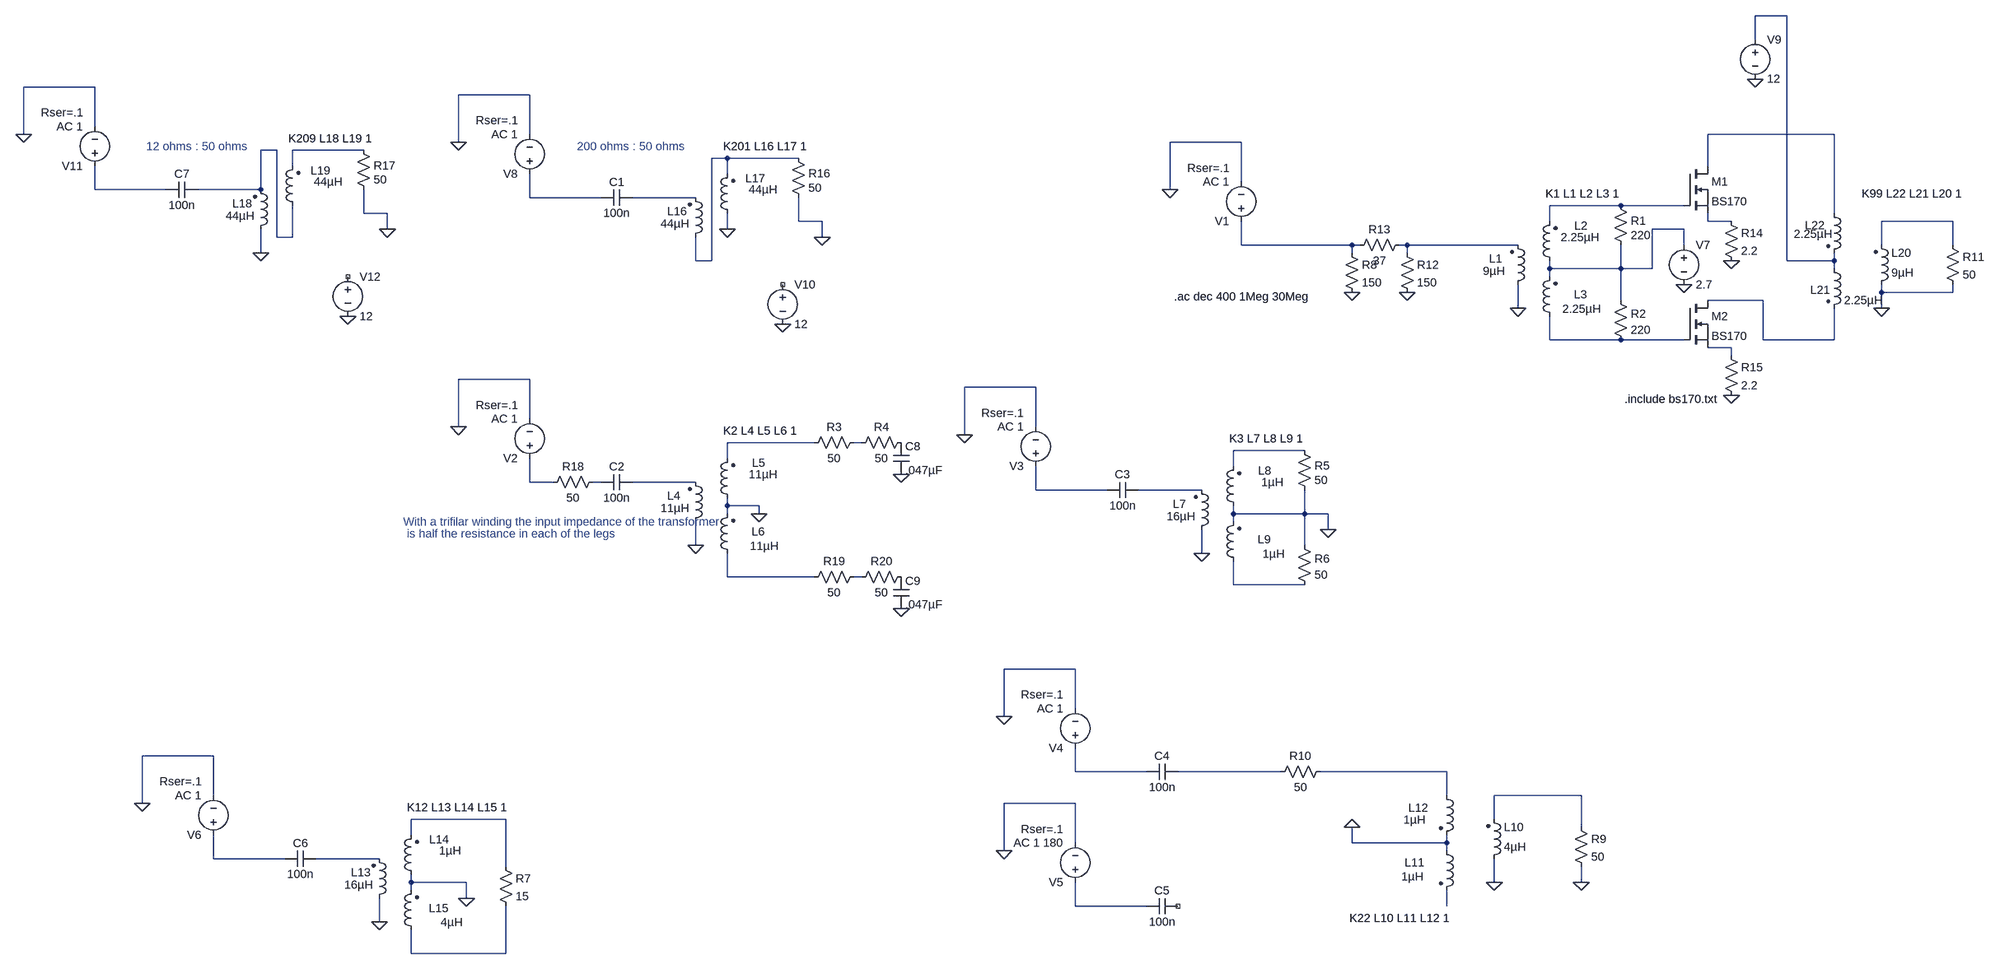
[diagram p0: schematic pushpull impedance.asc]
pushpull impedance.asc, the LTspice schematic file:
Version 4
SHEET 1 2848 1376
WIRE 2448 -1104 2384 -1104
WIRE 2384 -1056 2384 -1104
WIRE -976 -960 -1120 -960
WIRE -96 -944 -240 -944
WIRE -976 -880 -976 -960
WIRE -1120 -864 -1120 -960
WIRE -96 -864 -96 -944
WIRE 2544 -864 2288 -864
WIRE -240 -848 -240 -944
WIRE 1344 -848 1200 -848
WIRE -608 -832 -640 -832
WIRE -432 -832 -576 -832
WIRE 304 -816 272 -816
WIRE 448 -816 304 -816
WIRE -576 -800 -576 -832
WIRE 2288 -800 2288 -864
WIRE 304 -784 304 -816
WIRE 1344 -768 1344 -848
WIRE -976 -752 -976 -800
WIRE -832 -752 -976 -752
WIRE -640 -752 -640 -832
WIRE -640 -752 -768 -752
WIRE 1200 -752 1200 -848
WIRE -96 -736 -96 -784
WIRE 48 -736 -96 -736
WIRE 240 -736 112 -736
WIRE 2112 -720 1968 -720
WIRE 2240 -720 2112 -720
WIRE -432 -704 -432 -752
WIRE -384 -704 -432 -704
WIRE 2544 -704 2544 -864
WIRE 448 -688 448 -736
WIRE 496 -688 448 -688
WIRE 1968 -688 1968 -720
WIRE 2288 -688 2288 -704
WIRE 2336 -688 2288 -688
WIRE 2784 -688 2640 -688
WIRE -384 -672 -384 -704
WIRE 304 -672 304 -704
WIRE 2240 -672 2176 -672
WIRE -608 -656 -608 -832
WIRE -576 -656 -576 -720
WIRE -576 -656 -608 -656
WIRE 496 -656 496 -688
WIRE 1344 -640 1344 -688
WIRE 1568 -640 1344 -640
WIRE 1584 -640 1568 -640
WIRE 1680 -640 1664 -640
WIRE 1904 -640 1680 -640
WIRE 2240 -640 2240 -672
WIRE 2640 -640 2640 -688
WIRE 2784 -640 2784 -688
WIRE -640 -624 -640 -672
WIRE 1568 -624 1568 -640
WIRE 1680 -624 1680 -640
WIRE 240 -608 240 -656
WIRE 272 -608 272 -816
WIRE 272 -608 240 -608
WIRE 2448 -608 2448 -1104
WIRE 2544 -608 2544 -624
WIRE 2544 -608 2448 -608
WIRE 1968 -592 1968 -608
WIRE 2112 -592 2112 -640
WIRE 2112 -592 1968 -592
WIRE 2176 -592 2176 -672
WIRE 2176 -592 2112 -592
WIRE 2544 -592 2544 -608
WIRE 1968 -576 1968 -592
WIRE 2640 -544 2640 -560
WIRE 2784 -544 2784 -560
WIRE 2784 -544 2640 -544
WIRE 2112 -528 2112 -592
WIRE 2400 -528 2288 -528
WIRE 1904 -512 1904 -560
WIRE 2640 -512 2640 -544
WIRE 1968 -448 1968 -496
WIRE 2112 -448 1968 -448
WIRE 2240 -448 2112 -448
WIRE 2400 -448 2400 -528
WIRE 2544 -448 2544 -512
WIRE 2544 -448 2400 -448
WIRE 2336 -432 2288 -432
WIRE 2336 -416 2336 -432
WIRE -96 -368 -240 -368
WIRE 928 -352 784 -352
WIRE -96 -288 -96 -368
WIRE -240 -272 -240 -368
WIRE 928 -272 928 -352
WIRE 784 -256 784 -352
WIRE 480 -240 304 -240
WIRE 576 -240 560 -240
WIRE 1472 -224 1328 -224
WIRE 304 -208 304 -240
WIRE 1328 -192 1328 -224
WIRE -96 -160 -96 -208
WIRE -48 -160 -96 -160
WIRE 48 -160 32 -160
WIRE 240 -160 112 -160
WIRE 928 -144 928 -192
WIRE 1072 -144 928 -144
WIRE 1264 -144 1136 -144
WIRE 304 -112 304 -128
WIRE 368 -112 304 -112
WIRE 304 -96 304 -112
WIRE 368 -96 368 -112
WIRE 1328 -96 1328 -112
WIRE 1472 -96 1472 -144
WIRE 1472 -96 1328 -96
WIRE 1520 -96 1472 -96
WIRE 1328 -80 1328 -96
WIRE 1520 -64 1520 -96
WIRE 240 -32 240 -80
WIRE 1472 -32 1472 -96
WIRE 1264 -16 1264 -64
WIRE 304 32 304 -16
WIRE 480 32 304 32
WIRE 576 32 560 32
WIRE 1328 48 1328 0
WIRE 1472 48 1328 48
WIRE 1008 240 864 240
WIRE 1008 320 1008 240
WIRE 864 336 864 240
WIRE -736 416 -880 416
WIRE 1008 448 1008 400
WIRE 1152 448 1008 448
WIRE 1424 448 1216 448
WIRE 1760 448 1504 448
WIRE -736 496 -736 416
WIRE 1760 496 1760 448
WIRE 2032 496 1856 496
WIRE -880 512 -880 416
WIRE 1008 512 864 512
WIRE -144 544 -336 544
WIRE 1856 544 1856 496
WIRE 2032 560 2032 496
WIRE -336 576 -336 544
WIRE 1008 592 1008 512
WIRE 1568 592 1568 560
WIRE 1760 592 1760 576
WIRE 1760 592 1568 592
WIRE 864 608 864 512
WIRE 1760 608 1760 592
WIRE -736 624 -736 576
WIRE -592 624 -736 624
WIRE -400 624 -528 624
WIRE -144 640 -144 544
WIRE -336 672 -336 656
WIRE -224 672 -336 672
WIRE 1856 672 1856 624
WIRE 2032 672 2032 640
WIRE -336 688 -336 672
WIRE -224 704 -224 672
WIRE 1008 720 1008 672
WIRE 1152 720 1008 720
WIRE 1760 720 1760 688
WIRE -400 752 -400 704
WIRE -336 816 -336 768
WIRE -144 816 -144 720
WIRE -144 816 -336 816
FLAG 1904 -512 0
FLAG 1200 -752 0
FLAG 240 -32 0
FLAG -240 -272 0
FLAG 1264 -16 0
FLAG 784 -256 0
FLAG 1520 -64 0
FLAG 1856 672 0
FLAG 864 336 0
FLAG 1568 560 0
FLAG 2032 672 0
FLAG 864 608 0
FLAG -400 752 0
FLAG -880 512 0
FLAG -224 704 0
FLAG 2384 -976 0
FLAG 2640 -512 0
FLAG 2240 -560 0
FLAG 1568 -544 0
FLAG 1680 -544 0
FLAG 2336 -608 0
FLAG 2336 -336 0
FLAG -240 -848 0
FLAG 496 -656 0
FLAG 416 -480 0
FLAG 304 -672 0
FLAG -1120 -864 0
FLAG -384 -672 0
FLAG -464 -496 0
FLAG -640 -624 0
FLAG 368 -96 0
FLAG 656 -176 0
FLAG 656 96 0
SYMBOL ind2 1888 -544 M180
WINDOW 0 -42 68 Left 2
WINDOW 3 -55 43 Left 2
SYMATTR InstName L1
SYMATTR Value 9µH
SYMATTR Type ind
SYMBOL ind2 1984 -592 R180
WINDOW 0 -61 87 Left 2
WINDOW 3 -85 64 Left 2
SYMATTR InstName L2
SYMATTR Value 2.25µH
SYMATTR Type ind
SYMBOL ind2 1984 -480 R180
WINDOW 0 -60 60 Left 2
WINDOW 3 -88 31 Left 2
SYMATTR InstName L3
SYMATTR Value 2.25µH
SYMATTR Type ind
SYMBOL res 2096 -736 R0
WINDOW 0 36 47 Left 2
SYMATTR InstName R1
SYMATTR Value 220
SYMBOL res 2096 -544 R0
WINDOW 0 36 43 Left 2
SYMATTR InstName R2
SYMATTR Value 220
SYMBOL voltage 1344 -672 R180
WINDOW 123 24 96 Left 2
WINDOW 39 24 124 Left 2
WINDOW 3 46 103 Left 2
SYMATTR Value2 AC 1
SYMATTR SpiceLine Rser=.1
SYMATTR Value ""
SYMATTR InstName V1
SYMBOL ind2 224 -64 M180
WINDOW 0 -42 68 Left 2
WINDOW 3 -55 43 Left 2
SYMATTR InstName L4
SYMATTR Value 11µH
SYMATTR Type ind
SYMBOL ind2 320 -112 R180
WINDOW 0 -61 87 Left 2
WINDOW 3 -85 64 Left 2
SYMATTR InstName L5
SYMATTR Value 11µH
SYMATTR Type ind
SYMBOL ind2 320 0 R180
WINDOW 0 -60 60 Left 2
WINDOW 3 -88 31 Left 2
SYMATTR InstName L6
SYMATTR Value 11µH
SYMATTR Type ind
SYMBOL voltage -96 -192 R180
WINDOW 123 24 96 Left 2
WINDOW 39 24 124 Left 2
WINDOW 3 46 103 Left 2
SYMATTR Value2 AC 1
SYMATTR SpiceLine Rser=.1
SYMATTR Value ""
SYMATTR InstName V2
SYMBOL cap 112 -176 R90
WINDOW 0 0 32 VBottom 2
WINDOW 3 32 32 VTop 2
SYMATTR InstName C2
SYMATTR Value 100n
SYMBOL ind2 1248 -48 M180
WINDOW 0 -42 68 Left 2
WINDOW 3 -55 43 Left 2
SYMATTR InstName L7
SYMATTR Value 16µH
SYMATTR Type ind
SYMBOL ind2 1344 -96 R180
WINDOW 0 -61 87 Left 2
WINDOW 3 -85 64 Left 2
SYMATTR InstName L8
SYMATTR Value 1µH
SYMATTR Type ind
SYMBOL ind2 1344 16 R180
WINDOW 0 -60 60 Left 2
WINDOW 3 -88 31 Left 2
SYMATTR InstName L9
SYMATTR Value 1µH
SYMATTR Type ind
SYMBOL res 1456 -240 R0
WINDOW 0 36 47 Left 2
SYMATTR InstName R5
SYMATTR Value 50
SYMBOL res 1456 -48 R0
WINDOW 0 36 43 Left 2
SYMATTR InstName R6
SYMATTR Value 50
SYMBOL voltage 928 -176 R180
WINDOW 123 24 96 Left 2
WINDOW 39 24 124 Left 2
WINDOW 3 46 103 Left 2
SYMATTR Value2 AC 1
SYMATTR SpiceLine Rser=.1
SYMATTR Value ""
SYMATTR InstName V3
SYMBOL cap 1136 -160 R90
WINDOW 0 0 32 VBottom 2
WINDOW 3 32 32 VTop 2
SYMATTR InstName C3
SYMATTR Value 100n
SYMBOL ind2 1840 640 M180
WINDOW 0 36 80 Left 2
WINDOW 3 36 40 Left 2
SYMATTR InstName L10
SYMATTR Value 4µH
SYMATTR Type ind
SYMBOL ind2 1744 592 R0
WINDOW 0 -69 40 Left 2
WINDOW 3 -76 68 Left 2
SYMATTR InstName L11
SYMATTR Value 1µH
SYMATTR Type ind
SYMBOL ind2 1744 480 R0
WINDOW 0 -62 41 Left 2
WINDOW 3 -72 65 Left 2
SYMATTR InstName L12
SYMATTR Value 1µH
SYMATTR Type ind
SYMBOL voltage 1008 416 R180
WINDOW 123 24 96 Left 2
WINDOW 39 24 124 Left 2
WINDOW 3 46 103 Left 2
SYMATTR Value2 AC 1
SYMATTR SpiceLine Rser=.1
SYMATTR Value ""
SYMATTR InstName V4
SYMBOL cap 1216 432 R90
WINDOW 0 0 32 VBottom 2
WINDOW 3 32 32 VTop 2
SYMATTR InstName C4
SYMATTR Value 100n
SYMBOL res 2016 544 R0
SYMATTR InstName R9
SYMATTR Value 50
SYMBOL voltage 1008 688 R180
WINDOW 123 24 96 Left 2
WINDOW 39 24 124 Left 2
WINDOW 3 46 103 Left 2
SYMATTR Value2 AC 1 180
SYMATTR SpiceLine Rser=.1
SYMATTR Value ""
SYMATTR InstName V5
SYMBOL cap 1216 704 R90
WINDOW 0 0 32 VBottom 2
WINDOW 3 32 32 VTop 2
SYMATTR InstName C5
SYMATTR Value 100n
SYMBOL ind2 -416 720 M180
WINDOW 0 -42 68 Left 2
WINDOW 3 -55 43 Left 2
SYMATTR InstName L13
SYMATTR Value 16µH
SYMATTR Type ind
SYMBOL ind2 -320 672 R180
WINDOW 0 -61 87 Left 2
WINDOW 3 -85 64 Left 2
SYMATTR InstName L14
SYMATTR Value 1µH
SYMATTR Type ind
SYMBOL ind2 -320 784 R180
WINDOW 0 -60 60 Left 2
WINDOW 3 -88 31 Left 2
SYMATTR InstName L15
SYMATTR Value 4µH
SYMATTR Type ind
SYMBOL voltage -736 592 R180
WINDOW 123 24 96 Left 2
WINDOW 39 24 124 Left 2
WINDOW 3 46 103 Left 2
SYMATTR Value2 AC 1
SYMATTR SpiceLine Rser=.1
SYMATTR Value ""
SYMATTR InstName V6
SYMBOL cap -528 608 R90
WINDOW 0 0 32 VBottom 2
WINDOW 3 32 32 VTop 2
SYMATTR InstName C6
SYMATTR Value 100n
SYMBOL res -160 624 R0
SYMATTR InstName R7
SYMATTR Value 15
SYMBOL res 1520 432 R90
WINDOW 0 0 56 VBottom 2
WINDOW 3 32 56 VTop 2
SYMATTR InstName R10
SYMATTR Value 50
SYMBOL nmos 2240 -800 R0
SYMATTR InstName M1
SYMATTR Value BS170
SYMATTR Prefix X
SYMBOL nmos 2240 -528 R0
SYMATTR InstName M2
SYMATTR Value BS170
SYMATTR Prefix X
SYMBOL voltage 2384 -1072 R0
WINDOW 123 0 0 Left 0
WINDOW 39 0 0 Left 0
SYMATTR InstName V9
SYMATTR Value 12
SYMBOL ind2 2624 -544 M180
WINDOW 0 36 80 Left 2
WINDOW 3 36 40 Left 2
SYMATTR InstName L20
SYMATTR Value 9µH
SYMATTR Type ind
SYMBOL ind2 2528 -608 R0
WINDOW 0 -32 59 Left 2
SYMATTR InstName L21
SYMATTR Value 2.25µH
SYMATTR Type ind
SYMBOL ind2 2528 -720 R0
WINDOW 0 -43 40 Left 2
WINDOW 3 -66 58 Left 2
SYMATTR InstName L22
SYMATTR Value 2.25µH
SYMATTR Type ind
SYMBOL res 2768 -656 R0
SYMATTR InstName R11
SYMATTR Value 50
SYMBOL voltage 2240 -656 R0
WINDOW 123 0 0 Left 0
WINDOW 39 0 0 Left 0
SYMATTR InstName V7
SYMATTR Value 2.7
SYMBOL res 1552 -640 R0
SYMATTR InstName R8
SYMATTR Value 150
SYMBOL res 1664 -640 R0
SYMATTR InstName R12
SYMATTR Value 150
SYMBOL res 1680 -656 R90
WINDOW 0 0 56 VBottom 2
WINDOW 3 32 56 VTop 2
SYMATTR InstName R13
SYMATTR Value 37
SYMBOL res 2320 -704 R0
SYMATTR InstName R14
SYMATTR Value 2.2
SYMBOL res 2320 -432 R0
SYMATTR InstName R15
SYMATTR Value 2.2
SYMBOL ind2 224 -640 M180
WINDOW 0 -42 68 Left 2
WINDOW 3 -55 43 Left 2
SYMATTR InstName L16
SYMATTR Value 44µH
SYMATTR Type ind
SYMBOL ind2 320 -688 R180
WINDOW 0 -61 87 Left 2
WINDOW 3 -85 64 Left 2
SYMATTR InstName L17
SYMATTR Value 44µH
SYMATTR Type ind
SYMBOL res 432 -832 R0
WINDOW 0 36 47 Left 2
SYMATTR InstName R16
SYMATTR Value 50
SYMBOL voltage -96 -768 R180
WINDOW 123 24 96 Left 2
WINDOW 39 24 124 Left 2
WINDOW 3 46 103 Left 2
SYMATTR Value2 AC 1
SYMATTR SpiceLine Rser=.1
SYMATTR Value ""
SYMATTR InstName V8
SYMBOL cap 112 -752 R90
WINDOW 0 0 32 VBottom 2
WINDOW 3 32 32 VTop 2
SYMATTR InstName C1
SYMATTR Value 100n
SYMBOL voltage 416 -576 R0
WINDOW 123 0 0 Left 0
WINDOW 39 0 0 Left 0
SYMATTR InstName V10
SYMATTR Value 12
SYMBOL ind2 -656 -656 M180
WINDOW 0 -42 68 Left 2
WINDOW 3 -55 43 Left 2
SYMATTR InstName L18
SYMATTR Value 44µH
SYMATTR Type ind
SYMBOL ind2 -560 -704 R180
WINDOW 0 -61 87 Left 2
WINDOW 3 -85 64 Left 2
SYMATTR InstName L19
SYMATTR Value 44µH
SYMATTR Type ind
SYMBOL res -448 -848 R0
WINDOW 0 36 47 Left 2
SYMATTR InstName R17
SYMATTR Value 50
SYMBOL voltage -976 -784 R180
WINDOW 123 24 96 Left 2
WINDOW 39 24 124 Left 2
WINDOW 3 46 103 Left 2
SYMATTR Value2 AC 1
SYMATTR SpiceLine Rser=.1
SYMATTR Value ""
SYMATTR InstName V11
SYMBOL cap -768 -768 R90
WINDOW 0 0 32 VBottom 2
WINDOW 3 32 32 VTop 2
SYMATTR InstName C7
SYMATTR Value 100n
SYMBOL voltage -464 -592 R0
WINDOW 123 0 0 Left 0
WINDOW 39 0 0 Left 0
SYMATTR InstName V12
SYMATTR Value 12
SYMBOL res 48 -176 R90
WINDOW 0 0 56 VBottom 2
WINDOW 3 32 56 VTop 2
SYMATTR InstName R18
SYMATTR Value 50
SYMBOL res 576 -256 R90
WINDOW 0 0 56 VBottom 2
WINDOW 3 32 56 VTop 2
SYMATTR InstName R3
SYMATTR Value 50
SYMBOL res 672 -256 R90
WINDOW 0 0 56 VBottom 2
WINDOW 3 32 56 VTop 2
SYMATTR InstName R4
SYMATTR Value 50
SYMBOL res 576 16 R90
WINDOW 0 0 56 VBottom 2
WINDOW 3 32 56 VTop 2
SYMATTR InstName R19
SYMATTR Value 50
SYMBOL res 672 16 R90
WINDOW 0 0 56 VBottom 2
WINDOW 3 32 56 VTop 2
SYMATTR InstName R20
SYMATTR Value 50
SYMBOL cap 640 -240 R0
SYMATTR InstName C8
SYMATTR Value .047µF
SYMBOL cap 640 32 R0
SYMATTR InstName C9
SYMATTR Value .047µF
TEXT 1960 -744 Left 2 !K1 L1 L2 L3 1
TEXT 1208 -536 Left 2 !.ac dec 400 1Meg 30Meg
TEXT 296 -264 Left 2 !K2 L4 L5 L6 1
TEXT 1320 -248 Left 2 !K3 L7 L8 L9 1
TEXT 1768 744 Right 2 !K22 L10 L11 L12 1
TEXT -344 520 Left 2 !K12 L13 L14 L15 1
TEXT 2600 -744 Left 2 !K99 L22 L21 L20 1
TEXT 2120 -328 Left 2 !.include bs170.txt
TEXT 296 -840 Left 2 !K201 L16 L17 1
TEXT -584 -856 Left 2 !K209 L18 L19 1
TEXT -872 -840 Left 2 ;12 ohms : 50 ohms
TEXT 0 -840 Left 2 ;200 ohms : 50 ohms
TEXT -352 -80 Left 2 ;With a trifilar winding the input impedance of the transformer
TEXT -344 -56 Left 2 ;is half the resistance in each of the legs

The netlist it stands for:
* pushpull impedance.asc
L1 0 N014 9µH
L2 N012 N009 2.25µH
L3 N016 N012 2.25µH
R1 N009 N012 220
R2 N012 N016 220
V1 N013 0 AC 1 Rser=.1
L4 0 N023 11µH
L5 0 N018 11µH
L6 N026 0 11µH
V2 N021 0 AC 1 Rser=.1
C2 N023 N022 100n
L7 0 N025 16µH
L8 0 N020 1µH
L9 N028 0 1µH
R5 N020 0 50
R6 0 N028 50
V3 N024 0 AC 1 Rser=.1
C3 N025 N024 100n
L10 0 N032 4µH
L11 0 N037 1µH
L12 N031 0 1µH
V4 N029 0 AC 1 Rser=.1
C4 N030 N029 100n
R9 N032 0 50
V5 N036 0 AC 1 180 Rser=.1
C5 NC_01 N036 100n
L13 0 N035 16µH
L14 0 N033 1µH
L15 N038 0 4µH
V6 N034 0 AC 1 Rser=.1
C6 N035 N034 100n
R7 N033 N038 15
R10 N031 N030 50
XM1 N002 N009 N010 BS170  ; pins D G S
XM2 N015 N016 N017 BS170  ; pins D G S
V9 N001 0 12
L20 0 N011 9µH
L21 N001 N015 2.25µH
L22 N002 N001 2.25µH
R11 N011 0 50
V7 N012 0 2.7
R8 N013 0 150
R12 N014 0 150
R13 N014 N013 37
R14 N010 0 2.2
R15 N017 0 2.2
L16 N005 N008 44µH
L17 0 N005 44µH
R16 N005 0 50
V8 N007 0 AC 1 Rser=.1
C1 N008 N007 100n
V10 NC_02 0 12
L18 0 N003 44µH
L19 N003 N004 44µH
R17 N004 0 50
V11 N006 0 AC 1 Rser=.1
C7 N003 N006 100n
V12 NC_03 0 12
R18 N022 N021 50
R3 N019 N018 50
R4 P001 N019 50
R19 N027 N026 50
R20 P002 N027 50
C8 P001 0 .047µF
C9 P002 0 .047µF
K1 L1 L2 L3 1
.ac dec 400 1Meg 30Meg
K2 L4 L5 L6 1
K3 L7 L8 L9 1
K22 L10 L11 L12 1
K12 L13 L14 L15 1
K99 L22 L21 L20 1
.include bs170.txt
K201 L16 L17 1
K209 L18 L19 1
* 12 ohms : 50 ohms
* 200 ohms : 50 ohms
* With a trifilar winding the input impedance of the transformer
* is half the resistance in each of the legs
.backanno
.end